# EAGLE board teensyShield4.1b (EAGLE 7.7.0)
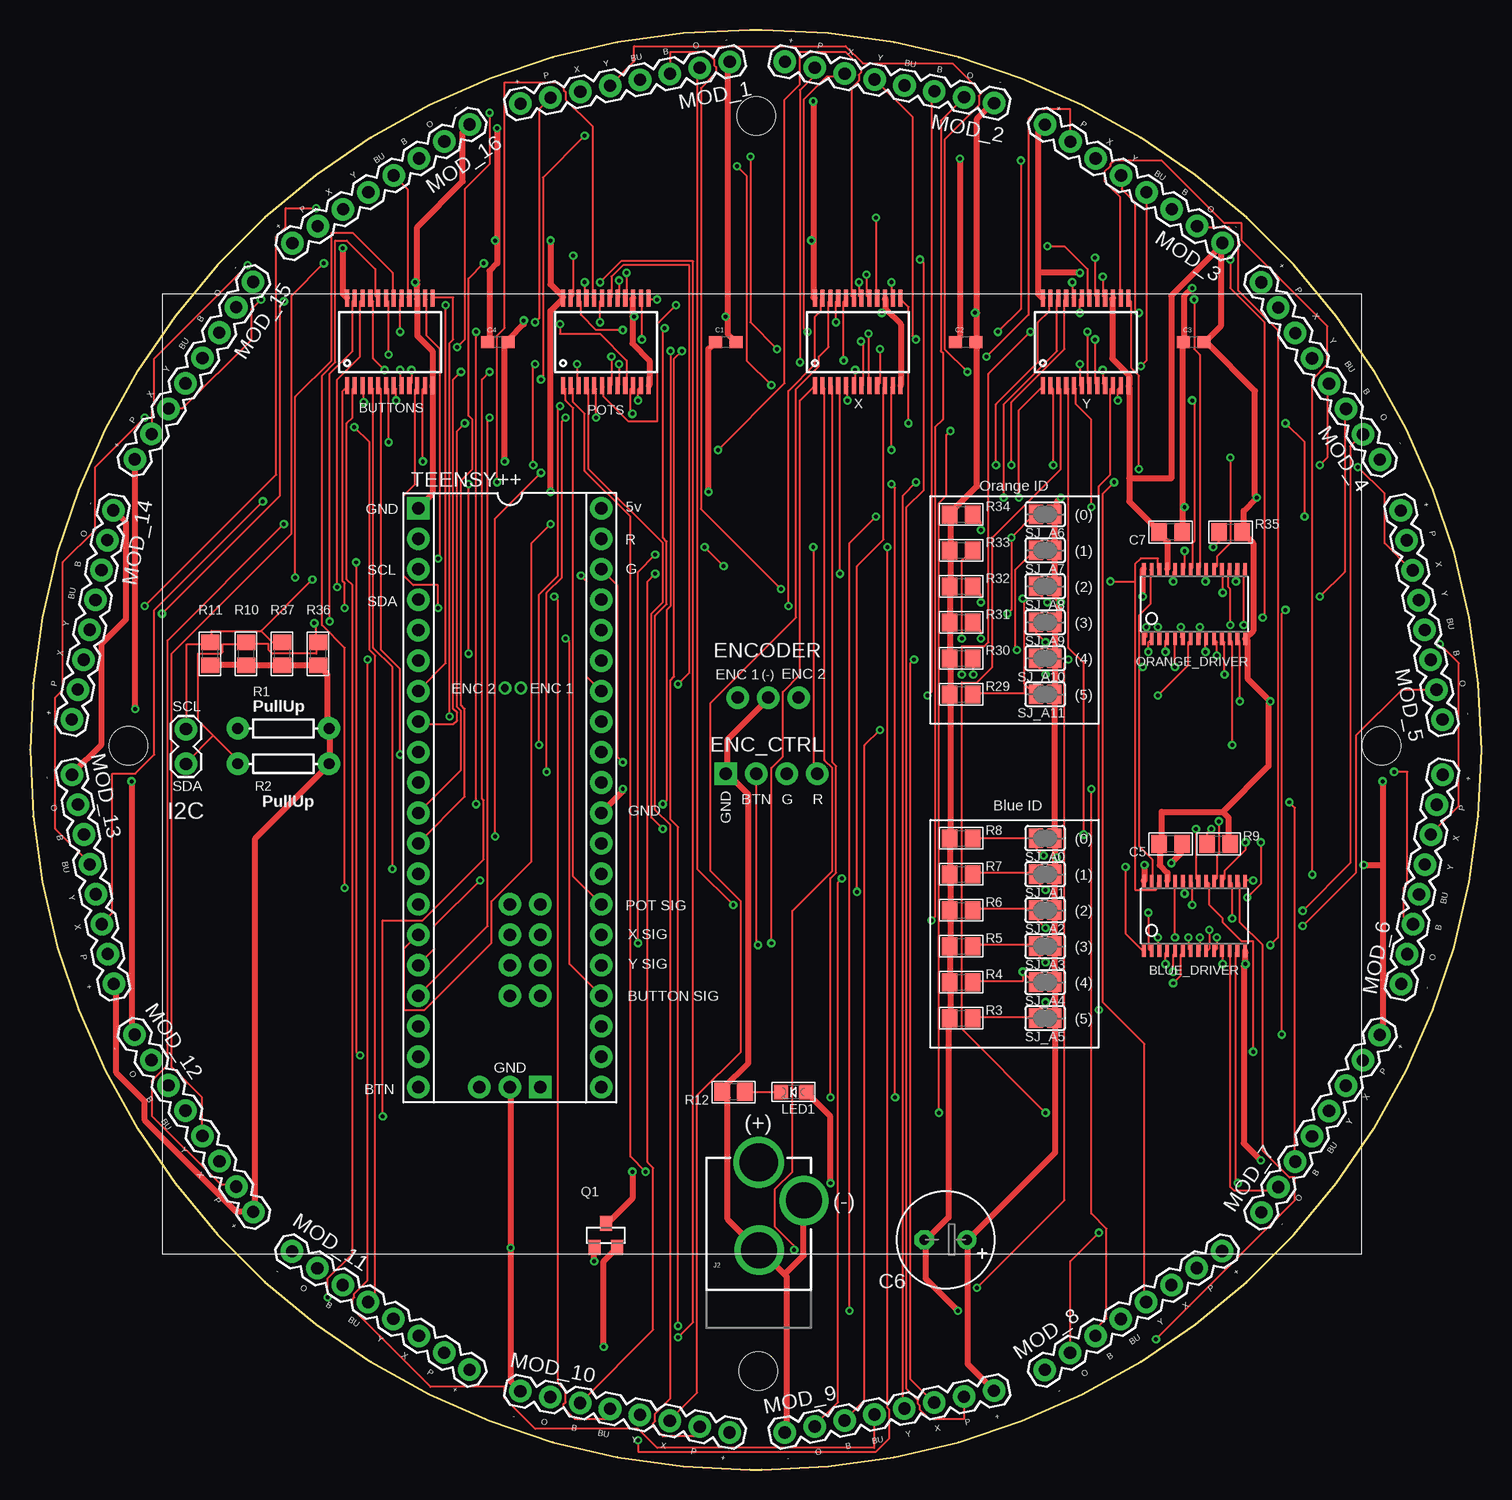
[diagram p2: board, top side]
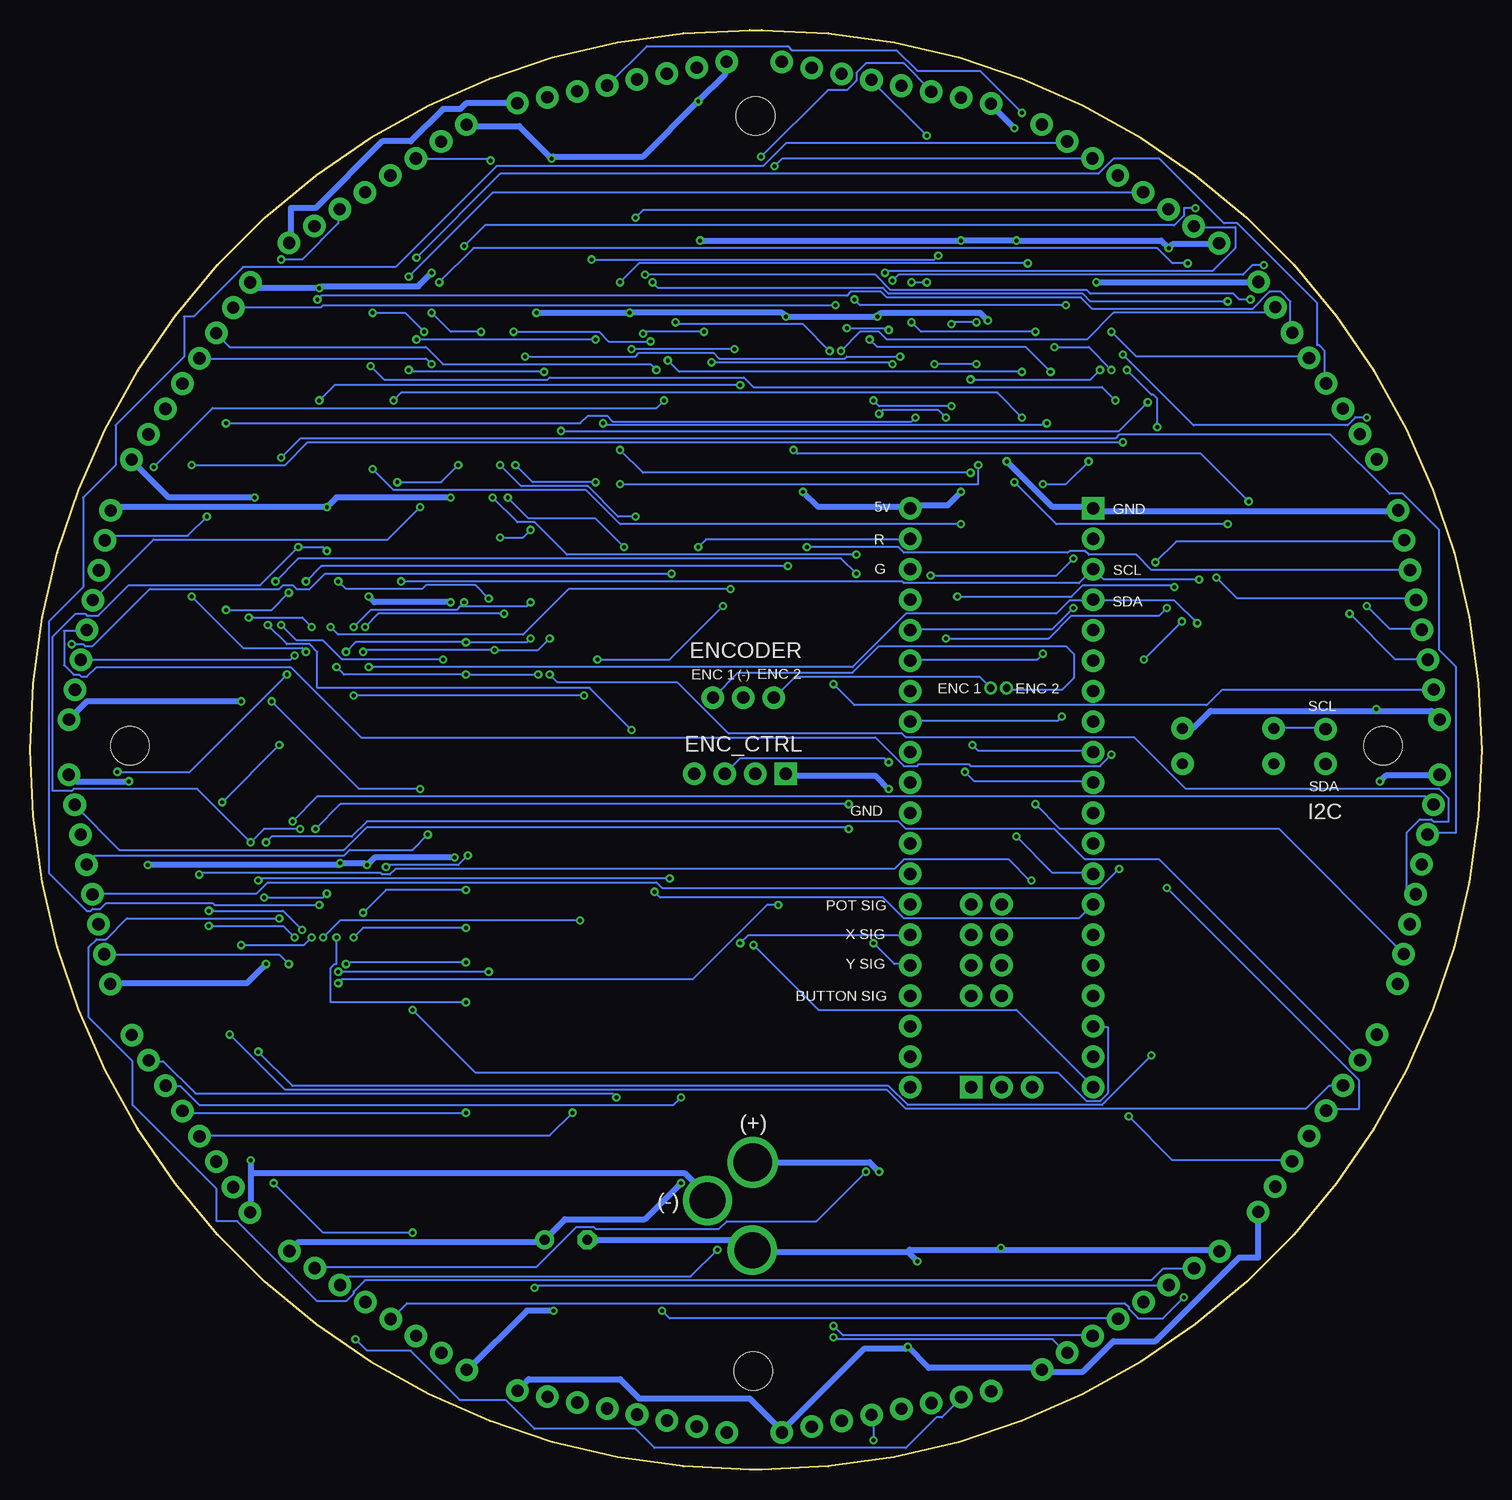
[diagram p3: board, bottom side, seen from below]

Size 121 x 120 mm. Coordinates in mm from the lower left corner, seen from the top.
Outline: 60,0 61,0 arc90 121,60 arc90 61,120 60,120 arc90 0,60 arc90 60,0
Copper layers (1*16): Top 0.0356mm / dielectric 1.5011mm / Bottom 0.0356mm
Design rules "oshpark-2layer": minimum track width 6mil, minimum drill 13mil, track to track 6mil, track to pad 6mil, pad to pad 6mil, via to via 6mil, smd to smd 6mil, copper to edge 15mil, drill to drill 6mil, minimum pad ring 7mil, minimum via ring 7mil, stop-mask expansion 2.5mil, vias tented up to drill 0mil, thermal gap 10mil
Net classes: 1 GND: width 0.508 mm; 2 5V: width 0.508 mm
Holes 3.2 mm at 8.2,60.35 60.7,8.2 112.67,60.35 60.52,112.85

## Footprints (pad centres in the part's own frame; a part is rotated, then mirrored left to right if it is on the bottom)
TSSOP28 = smd 0.305 x 0.991: 1 -4.225,-2.918; 2 -3.575,-2.918; 3 -2.925,-2.918; 4 -2.275,-2.918; 5 -1.625,-2.918; 6 -0.975,-2.918; 7 -0.325,-2.918; 8 0.325,-2.918; 9 0.975,-2.918; 10 1.625,-2.918; 11 2.275,-2.918; 12 2.925,-2.918; 13 3.575,-2.918; 14 4.225,-2.918; 15 4.225,2.918; 16 3.575,2.918; 17 2.925,2.918; 18 2.275,2.918; 19 1.625,2.918; 20 0.975,2.918; 21 0.325,2.918; 22 -0.325,2.918; 23 -0.975,2.918; 24 -1.625,2.918; 25 -2.275,2.918; 26 -2.925,2.918; 27 -3.575,2.918; 28 -4.225,2.918
SSOP24 = smd 0.348 x 1.397: 1 -3.575,-3.656; 2 -2.925,-3.656; 3 -2.275,-3.656; 4 -1.625,-3.656; 5 -0.975,-3.656; 6 -0.325,-3.656; 7 0.325,-3.656; 8 0.975,-3.656; 9 1.625,-3.656; 10 2.275,-3.656; 11 2.925,-3.656; 12 3.575,-3.656; 13 3.575,3.656; 14 2.925,3.656; 15 2.275,3.656; 16 1.625,3.656; 17 0.975,3.656; 18 0.325,3.656; 19 -0.325,3.656; 20 -0.975,3.656; 21 -1.625,3.656; 22 -2.275,3.656; 23 -2.925,3.656; 24 -3.575,3.656
0603 = smd 1.1 x 1: 1 -0.85,0; 2 0.85,0
0805 = smd 1.3 x 1.5: 1 -0.95,0; 2 0.95,0
E3,5-8 = drill 0.813 pad 1.6: + -1.778,0 | drill 0.813 pad 1.6 octagon: - 1.778,0
1X04_NO_SILK = drill 1.016 pad 1.88 square: 1 0,0 | drill 1.016 pad 1.88: 2 2.54,0; 3 5.08,0; 4 7.62,0
1X03_NO_SILK = drill 1.016 pad 1.88: 1 0,0; 2 2.54,0; 3 5.08,0
1X02_LOCK = drill 1.016 pad 1.88: 1 -0.178,0; 2 2.718,0
POWER_JACK_PTH_LOCK = drill 2.997 pad 4.115: GND 0.025,6.557; GNDBREAK 3.762,10.7 | drill 3.2 pad 4.115: PWR 0,13.878
CHIPLED_0805 = smd 1.2 x 1.2: A 0,-1.05; C 0,1.05
1X08_ROUND = drill 1.016 pad 1.88: 1 0,0; 2 2.54,0; 3 5.08,0; 4 7.62,0; 5 10.16,0; 6 12.7,0; 7 15.24,0; 8 17.78,0
SOT23-WIDE = smd 1 x 1.27: 1 -0.95,-1; 2 0.95,-1; 3 0,1
AXIAL-0.3 = drill 0.9 pad 1.88: P$1 -3.81,0; P$2 3.81,0
SOLDERJUMPER_REFLOW_NOPASTE = smd 1.168 x 1.6: 1 -0.762,0; 2 0.762,0
TEENSY++ = drill 1.016 pad 1.88: 5V 24.13,-2.54; +5V -24.13,7.62; A0 8.89,0; A1 11.43,0; A2 13.97,0; A3 16.51,0; A4 8.89,2.54; A5 11.43,2.54; A6 13.97,2.54; A7 16.51,2.54; B0 -6.35,7.62; B1 -8.89,7.62; B2 -11.43,7.62; B3 -13.97,7.62; B4 -16.51,7.62; B5 -19.05,7.62; B6 -21.59,7.62; B7 -21.59,-7.62; C0 6.35,-7.62; C1 8.89,-7.62; C2 11.43,-7.62; C3 13.97,-7.62; C4 16.51,-7.62; C5 19.05,-7.62; C6 21.59,-7.62; C7 24.13,-7.62; D0 -19.05,-7.62; D1 -16.51,-7.62; D2 -13.97,-7.62; D3 -11.43,-7.62; D4 -8.89,-7.62; D5 -6.35,-7.62; D6 -3.81,-7.62; D7 -1.27,-7.62; E0 1.27,-7.62; E1 3.81,-7.62; E6 -1.27,7.62; E7 -3.81,7.62; F0 6.35,7.62; F1 8.89,7.62; F2 11.43,7.62; F3 13.97,7.62; F4 16.51,7.62; F5 19.05,7.62; F6 21.59,7.62; F7 24.13,7.62; GND2 24.13,0; GRND1 1.27,7.62; REF 3.81,7.62 | drill 0.635 pad 1.067: E4 -9.144,0.914; E5 -9.144,-0.406 | drill 1.016 pad 1.88 square: GND -24.13,-7.62; RST 24.13,2.54

## Placement (x,y rotation side)
BLUE_DRIVER  PCA9685  [TSSOP28]  97.08,46.15 0 top
BUTTONS  MUX-74HC4067  [SSOP24]  30,94 0 top
C1  0.1uF  [0603]  58,94 0 top
C2  0.1uF  [0603]  78,94 0 top
C3  0.1uF  [0603]  97,94 0 top
C4  0.1uF  [0603]  39,94 0 top
C5  10uF  [0805]  95.08,52.15 180 top
C6  [E3,5-8]  76.33,19.15 180 top
C7  10uF  [0805]  95.08,78.15 180 top
ENC_CTRL  [1X04_NO_SILK]  58,58 0 top
ENCODER  [1X03_NO_SILK]  64.08,64.35 180 top
I2C  [1X02_LOCK]  13,59 90 top
J2  POWER_JACKPTH_LOCK  [POWER_JACK_PTH_LOCK]  60.76,11.72 0 top
LED1  VCC  [CHIPLED_0805]  63.65,31.48 90 top
MOD_1  [1X08_ROUND]  58.33,117.34 191.3 top
MOD_2  [1X08_ROUND]  80.37,113.9 168.8 top
MOD_3  [1X08_ROUND]  99.41,102.24 146.3 top
MOD_4  [1X08_ROUND]  112.53,84.19 123.8 top
MOD_5  [1X08_ROUND]  117.75,62.51 101.3 top
MOD_6  [1X08_ROUND]  114.31,40.47 78.8 top
MOD_7  [1X08_ROUND]  102.65,21.43 56.3 top
MOD_8  [1X08_ROUND]  84.6,8.31 33.8 top
MOD_9  [1X08_ROUND]  62.92,3.09 11.3 top
MOD_10  [1X08_ROUND]  40.88,6.53 348.8 top
MOD_11  [1X08_ROUND]  21.84,18.19 326.3 top
MOD_12  [1X08_ROUND]  8.72,36.24 303.8 top
MOD_13  [1X08_ROUND]  3.5,57.92 281.3 top
MOD_14  [1X08_ROUND]  6.94,79.96 258.8 top
MOD_15  [1X08_ROUND]  18.6,99 236.3 top
MOD_16  [1X08_ROUND]  36.65,112.12 213.8 top
ORANGE_DRIVER  PCA9685  [TSSOP28]  97.08,72.15 0 top
POTS  MUX-74HC4067  [SSOP24]  48,94 0 top
Q1  IRLML6401  [SOT23-WIDE]  48,19.52 0 top
R1  PullUp  [AXIAL-0.3]  21.12,61.77 0 top
R2  PullUp  [AXIAL-0.3]  21.12,58.83 180 top
R3  10K  [0805]  77.62,37.62 0 top
R4  10K  [0805]  77.62,40.62 0 top
R5  10K  [0805]  77.62,43.62 0 top
R6  10K  [0805]  77.62,46.62 0 top
R7  10K  [0805]  77.62,49.62 0 top
R8  10K  [0805]  77.62,52.62 0 top
R9  10K  [0805]  99.08,52.15 0 top
R10  10K  [0805]  18,68 270 top
R11  10K  [0805]  15,68 270 top
R12  220  [0805]  58.65,31.48 180 top
R29  10K  [0805]  77.62,64.62 0 top
R30  10K  [0805]  77.62,67.62 0 top
R31  10K  [0805]  77.62,70.62 0 top
R32  10K  [0805]  77.62,73.62 0 top
R33  10K  [0805]  77.62,76.62 0 top
R34  10K  [0805]  77.62,79.62 0 top
R35  10K  [0805]  100.08,78.15 0 top
R36  10K  [0805]  24,68 270 top
R37  10K  [0805]  21,68 270 top
SJ_A0  [SOLDERJUMPER_REFLOW_NOPASTE]  84.62,52.62 180 top
SJ_A1  [SOLDERJUMPER_REFLOW_NOPASTE]  84.62,49.62 180 top
SJ_A2  [SOLDERJUMPER_REFLOW_NOPASTE]  84.62,46.62 180 top
SJ_A3  [SOLDERJUMPER_REFLOW_NOPASTE]  84.62,43.62 180 top
SJ_A4  [SOLDERJUMPER_REFLOW_NOPASTE]  84.62,40.62 180 top
SJ_A5  [SOLDERJUMPER_REFLOW_NOPASTE]  84.62,37.62 180 top
SJ_A6  [SOLDERJUMPER_REFLOW_NOPASTE]  84.62,79.62 180 top
SJ_A7  [SOLDERJUMPER_REFLOW_NOPASTE]  84.62,76.62 180 top
SJ_A8  [SOLDERJUMPER_REFLOW_NOPASTE]  84.62,73.62 180 top
SJ_A9  [SOLDERJUMPER_REFLOW_NOPASTE]  84.62,70.62 180 top
SJ_A10  [SOLDERJUMPER_REFLOW_NOPASTE]  84.62,67.62 180 top
SJ_A11  [SOLDERJUMPER_REFLOW_NOPASTE]  84.62,64.62 180 top
TEENSY++  ARDUINO-TEENSY++  [TEENSY++]  40,56 270 top
X  MUX-74HC4067  [SSOP24]  69,94 0 top
Y  MUX-74HC4067  [SSOP24]  88,94 0 top

## Tracks (layer width: path | path; a pad name or v marks a point on that pad's centre or on a via)
5V  (via drill 0.33)
  Top 0.508: R11.2 15.13,67.05 17.98,67.05 R10.2 18.14,67.05 20.84,67.05 R37.2 21.16,67.05 23.86,67.05 R36.2 24.18,66.9 24.81,66.26 24.81,61.97 R1.P$2 24.97,61.66 24.97,58.96 R2.P$1 24.81,58.64 18.78,52.61 18.78,21.65 MOD_12.8 18.46,21.49 17.19,21.49 9.57,29.11 9.57,30.7 7.19,33.08 7.19,40.23 7.03,40.38 MOD_13.8 | v8.78,63.4 8.78,84.2 MOD_15.8 | v47.83,10.22 47.83,17.36 48.94,18.48 Q1.2 | v56.56,81.5 56.56,93.41 57.04,93.88 C1.1 | v43.38,81.5 43.38,96.58 44.34,97.53 POTS.24 44.34,97.85 43.38,98.8 v43.38,102.45 | v26.08,101.82 26.08,98.01 26.4,97.69 BUTTONS.24 | v38.94,111.82 38.94,102.45 | 38.94,102.45 38.94,100.55 38.3,99.92 38.3,94.04 C4.1 | v38.78,102.45 38.94,102.45 | v66.72,23.87 66.72,29.43 64.82,31.34 LED1.A | MOD_9.8 80.22,6.73 78.15,8.79 78.15,19.11 C6.+ 78.31,19.27 85.45,26.41 85.45,37.37 SJ_A5.1 85.45,37.69 85.45,40.54 SJ_A4.1 85.45,40.86 85.45,43.56 SJ_A3.1 85.45,43.88 85.45,46.58 SJ_A2.1 85.45,46.73 85.45,49.43 SJ_A1.1 85.45,49.75 85.45,51.02 | v65.29,114.04 65.29,102.45 | 65.29,102.45 65.29,97.69 X.24 | v77.52,109.28 77.52,94.36 77.2,94.04 C2.1 | 84.03,99.76 84.03,111.5 84.5,111.98 MOD_3.8 | 84.03,99.76 84.03,98.01 84.34,97.69 Y.24 | 96.09,80.23 96.09,78.17 C7.1 | 96.09,80.23 96.09,93.88 C3.1 96.25,94.2 96.25,97.85 v96.88,98.49 | v96.25,80.23 96.09,80.23 | v112.76,57.37 112.76,50.38 | 112.76,50.38 112.76,36.41 112.6,36.26 MOD_7.8 | v92.76,72.77 92.76,74.99 ORANGE_DRIVER.28 | v92.92,50.38 92.92,49.11 BLUE_DRIVER.28 | v95.14,50.54 95.93,51.34 95.93,52.13 C5.1 | 85.45,51.02 85.45,52.61 SJ_A0.1 85.45,52.77 85.45,64.51 SJ_A11.1 85.45,64.67 85.45,67.53 SJ_A10.1 85.45,67.85 85.45,70.39 SJ_A9.1 85.45,70.7 85.77,71.02 85.77,72.13 v85.93,72.29 85.45,72.77 85.45,73.56 SJ_A8.1 85.45,73.88 85.45,76.58 SJ_A7.1 85.45,76.74 85.45,79.59 SJ_A6.1 85.61,79.75 85.61,80.71 v85.93,81.02
  Top 0.508: v85.61,51.02 85.45,51.02 | v111.17,50.38 112.76,50.38 | v87.52,99.76 84.03,99.76 | v65.13,102.45 65.29,102.45
  Bottom 0.508: 8.78,63.24 22.59,63.24 24.02,61.81 24.81,61.81 R1.P$2 | 8.78,63.24 4.17,63.24 3.54,62.61 MOD_14.8 | v8.78,63.4 8.78,63.24 | MOD_12.8 18.62,21.33 18.62,17.68 20.21,17.68 27.19,10.7 30.68,10.7 33.23,8.16 36.56,8.16 MOD_11.8 36.72,8.47 46.08,8.47 v47.83,10.22 47.99,10.06 51.48,10.06 58.31,3.24 MOD_10.8 58.47,3.39 61.01,5.94 70.21,5.94 71.8,7.52 79.42,7.52 80.22,6.73 MOD_9.8 | v56.56,81.5 55.29,80.23 47.67,80.23 TEENSY++.+5V 47.51,80.39 44.5,80.39 v43.38,81.5 | MOD_16.8 21.95,102.14 25.76,102.14 v26.08,101.82 26.72,102.45 v38.78,102.45 v43.38,102.45 v65.13,102.45 | v38.94,111.82 40.84,113.73 MOD_1.8 | v66.72,23.87 69.74,20.86 76.41,20.86 77.99,19.27 C6.+ 78.15,18.95 98.63,18.95 99.27,18.32 MOD_8.8 | MOD_2.8 63.07,117.22 63.07,116.27 v65.29,114.04 69.9,109.44 77.36,109.44 v77.52,109.28 80.22,111.98 84.5,111.98 MOD_3.8 | MOD_4.8 102.6,98.96 102.12,98.49 v96.88,98.49 96.72,98.64 88.63,98.64 v87.52,99.76 | MOD_5.8 114.19,80.07 114.03,80.23 v96.25,80.23 95.45,81.02 v85.93,81.02 | v112.76,57.37 117.2,57.37 117.68,57.85 MOD_6.8 | v92.76,72.77 92.28,72.29 v85.93,72.29 | v85.61,51.02 92.28,51.02 v92.92,50.38 93.07,50.54 v95.14,50.54 95.3,50.38 v111.17,50.38
B_A0  (via drill 0.33)
  Top 0.152: v91.33,50.23 91.33,44.67 92.76,43.24 BLUE_DRIVER.1 | v84.5,51.18 83.87,51.81 83.87,52.61 SJ_A0.2 83.71,52.61 78.63,52.61 R8.2
  Bottom 0.152: v91.33,50.23 91.17,50.38 85.3,50.38 v84.5,51.18
B_A1  (via drill 0.33)
  Top 0.152: v93.23,46.42 93.23,43.4 93.39,43.24 BLUE_DRIVER.2 | v84.66,48.32 83.87,49.11 83.87,49.59 SJ_A1.2 83.71,49.75 78.63,49.75 R7.2
  Bottom 0.152: v93.23,46.42 91.33,48.32 v84.66,48.32
B_A2  (via drill 0.33)
  Top 0.152: v94.03,44.35 94.03,43.24 BLUE_DRIVER.3 | v84.66,45.15 83.87,45.94 83.87,46.58 SJ_A2.2 83.71,46.73 78.63,46.73 R6.2
  Bottom 0.152: v94.03,44.35 93.23,45.15 v84.66,45.15
B_A3  (via drill 0.33)
  Top 0.152: v94.66,42.13 94.66,43.08 BLUE_DRIVER.4 | v84.66,42.29 83.87,43.08 83.87,43.56 SJ_A3.2 83.71,43.72 78.63,43.72 R5.2
  Bottom 0.152: v94.66,42.13 94.5,42.29 v84.66,42.29
B_A4  (via drill 0.33)
  Top 0.152: v95.3,41.5 95.3,42.92 95.45,43.08 BLUE_DRIVER.5 | SJ_A4.2 83.71,40.54 v82.75,41.5 82.75,40.7 78.63,40.7 R4.2
  Bottom 0.152: v82.75,41.5 v95.3,41.5
B_A5  (via drill 0.33)
  Top 0.152: v95.45,44.35 95.45,48.96 BLUE_DRIVER.24 | v84.66,38.95 83.87,38.16 83.87,37.69 SJ_A5.2 83.71,37.69 78.63,37.69 R3.2
  Bottom 0.152: v95.45,44.35 95.45,42.13 95.61,42.13 95.93,41.81 95.93,38.95 v84.66,38.95
ENC_1
  Bottom 0.152: ENCODER.3 58.94,64.35 57.2,66.1 41.87,66.1 TEENSY++.E4
ENC_2
  Bottom 0.152: ENCODER.1 64.02,64.35 61.96,66.42 52.43,66.42 50.21,68.64 34.64,68.64 34,68 34,66 35,65 39.45,65 TEENSY++.E5
ENC_BU  (via drill 0.33)
  Top 0.152: v60.69,43.72 60.53,43.88 60.53,57.85 ENC_CTRL.2
  Bottom 0.152: v60.69,43.72 55.29,38.32 38.78,38.32 32.43,31.97 TEENSY++.C7
ENC_G  (via drill 0.33)
  Top 0.152: v49.42,58.96 48.94,59.43 48.94,73.72 47.67,74.99 TEENSY++.B5
  Bottom 0.152: v49.42,58.96 49.73,59.27 61.8,59.27 ENC_CTRL.3
ENC_R  (via drill 0.33)
  Top 0.152: v65.29,76.9 65.29,58.32 ENC_CTRL.4
  Bottom 0.152: v65.29,76.9 64.66,77.53 47.67,77.53 TEENSY++.B6
GND  (via drill 0.33)
  Top 0.508: BLUE_DRIVER.14 101.33,43.08 v101.33,42.13 101.17,41.97 101.17,27.21 v102.6,25.78 | MOD_10.1 40.84,6.57 40.05,7.36 v40.05,18.48 40.05,31.81 TEENSY++.GND2 | v49.42,56.73 49.42,56.58 47.67,54.83 TEENSY++.GRND1 | ENCODER.2 61.48,64.2 58.15,60.86 58.15,58.01 ENC_CTRL.1 58.31,57.85 59.9,56.26 59.9,33.88 57.83,31.81 57.83,31.65 R12.2 57.83,31.34 58.15,31.02 58.15,20.86 60.69,18.32 J2.GND 61.01,18.16 62.91,16.25 | v47.04,17.36 47.04,18.48 Q1.1 | 62.91,16.25 63.07,16.09 63.07,3.24 MOD_9.1 | v77.36,13.24 74.66,15.94 74.66,19.11 C6.- 74.82,19.27 76.56,21.02 76.56,37.53 R3.1 76.72,37.69 76.72,40.54 R4.1 76.72,40.86 76.72,43.56 R5.1 76.72,43.72 76.72,46.42 R6.1 76.72,46.73 76.72,49.59 R7.1 76.72,49.75 76.72,52.61 R8.1 76.72,52.77 76.72,64.51 R29.1 76.72,64.67 76.72,67.53 R30.1 76.72,67.85 76.72,70.55 R31.1 76.72,70.86 76.72,73.56 R32.1 76.72,73.72 76.72,76.42 R33.1 76.72,76.74 76.72,79.44 R34.1 76.72,79.75 78.94,81.98 78.94,93.88 C2.2 78.94,94.2 78.94,96.42 | 62.91,16.25 64.5,17.84 64.5,22.29 J2.GNDBREAK | MOD_13.1 3.54,58.01 5.92,60.39 5.92,68.8 7.98,70.86 7.98,78.96 7.03,79.91 MOD_14.1 | v8.46,57.37 8.46,36.41 8.62,36.26 MOD_12.1 | v39.58,84.04 39.58,93.72 39.73,93.88 C4.2 39.89,94.2 41.16,95.47 v41.16,95.79 | MOD_16.1 36.56,111.98 36.08,111.5 36.08,107.38 32.27,103.57 32.27,99.12 v32.11,98.96 32.27,98.8 32.27,97.85 BUTTONS.15 32.27,97.53 32.27,94.52 33.54,93.25 33.54,90.39 BUTTONS.12 33.54,90.23 33.54,81.34 32.43,80.23 TEENSY++.GND | ORANGE_DRIVER.25 94.82,75.15 94.82,77.37 94.19,78.01 C7.2 94.03,78.33 91.64,80.71 91.64,82.61
  Top 0.508: Y.15 90.22,97.53 90.22,92.61 91.64,91.18 91.64,90.39 Y.12 91.64,90.23 91.64,82.61 | BLUE_DRIVER.25 94.82,49.11 94.82,49.75 94.19,50.38 94.19,52.13 C5.2 94.34,52.29 94.34,54.83 99.42,54.83 | 99.42,54.83 99.9,54.35 99.9,52.29 R9.2 | 101.33,69.28 101.96,69.91 101.96,77.21 101.17,78.01 R35.2 101.17,78.33 101.17,79.91 v102.28,81.02 102.12,81.18 102.12,89.91 98.15,93.88 C3.2 98,94.04 99.27,95.31 99.27,102.14 MOD_3.1 99.11,101.82 95.14,97.85 95.14,82.61 91.64,82.61 | 101.33,69.28 ORANGE_DRIVER.14 | 101.33,69.28 101.49,69.12 101.49,65.94 v103.39,64.04 103.23,63.88 103.23,58.64 99.42,54.83 | 71.33,96.74 72.59,95.47 72.59,90.39 X.12 | 71.33,96.74 71.33,97.53 X.15 | 50.21,96.11 50.21,97.53 POTS.15 | 50.21,96.11 50.21,93.88 51.64,92.45 51.64,90.39 POTS.12 | 58.15,96.11 58.15,117.06 58.31,117.22 MOD_1.1 | 58.15,96.11 58.15,94.68 58.78,94.04 C1.2 | v50.37,96.11 50.21,96.11 | v57.99,96.11 58.15,96.11 | v71.01,96.42 71.33,96.74 | 78.94,96.42 78.94,112.61 80.22,113.89 MOD_2.1 | v78.79,96.42 78.94,96.42
  Bottom 0.508: v101.33,42.13 102.92,40.54 114.19,40.54 MOD_6.1 | v102.6,25.78 102.6,24.67 | 102.6,24.67 102.6,21.49 MOD_7.1 | v49.42,56.73 50.53,57.85 57.99,57.85 ENC_CTRL.1 | 47.83,18.16 v47.04,17.36 | 47.83,18.16 60.69,18.16 J2.GND 61.01,18.32 61.8,19.11 74.5,19.11 C6.- | 40.05,18.32 47.67,18.32 47.83,18.16 | 40.05,18.32 21.95,18.32 MOD_11.1 | v77.36,13.24 79.58,13.24 84.5,8.32 MOD_8.1 | v40.05,18.48 40.05,18.32 | 102.6,24.67 66.4,24.67 64.66,22.92 64.66,22.45 J2.GNDBREAK | v8.46,57.37 7.98,57.85 3.54,57.85 MOD_13.1 | v39.58,84.04 35.77,80.23 32.43,80.23 TEENSY++.GND 32.27,79.91 7.03,79.91 MOD_14.1 | v32.11,98.96 18.62,98.96 MOD_15.1 | v103.39,64.04 116.25,64.04 117.68,62.61 MOD_5.1 | v102.28,81.02 109.42,81.02 112.44,84.04 MOD_4.1 | v78.79,96.42 v71.01,96.42 58.31,96.42 v57.99,96.11 v50.37,96.11 50.05,96.42 41.8,96.42 v41.16,95.79 | MOD_3.1 99.27,102.3 99.27,105.15 97.2,105.15 91.64,110.71 89.26,110.71 86.56,113.41 85.14,113.41 84.66,113.89 80.37,113.89 MOD_2.1
M1_BTN  (via drill 0.33)
  Top 0.152: v31.8,91.66 31.8,90.55 31.64,90.39 BUTTONS.9 | v42.59,90.87 42.75,91.03 42.75,107.69 v46.24,111.19
  Bottom 0.152: v31.8,91.66 32.59,90.87 v42.59,90.87 | v46.24,111.19 50.85,115.79 MOD_1.4
M1_LED1  (via drill 0.33)
  Top 0.152: v95.3,40.54 95.93,41.18 95.93,42.92 96.09,43.08 BLUE_DRIVER.6 | v58.62,47.05 55.61,50.07 55.61,116.58 55.77,116.74 MOD_1.2
  Bottom 0.152: v95.3,40.54 94.98,40.86 65.77,40.86 59.58,47.05 v58.62,47.05
M1_LED2  (via drill 0.33)
  Top 0.152: v95.93,70.23 95.93,69.44 96.09,69.28 ORANGE_DRIVER.6 | v62.59,73.4 55.93,80.07 55.93,115.16 57.2,116.42 57.2,116.9 57.04,117.06 57.04,117.54 56.4,118.17 53.39,118.17 53.39,116.42 MOD_1.3
  Bottom 0.152: v95.93,70.23 95.3,69.59 79.9,69.59 76.09,73.4 v62.59,73.4
M1_POT  (via drill 0.33)
  Top 0.152: v44.18,95.47 44.18,94.68 47.51,94.68 49.73,92.45 49.73,90.39 POTS.9 | v42.11,95.63 42.43,95.95 42.43,113.41 43.23,114.2 MOD_1.7
  Bottom 0.152: v44.18,95.47 44.02,95.63 v42.11,95.63
M1_X  (via drill 0.33)
  Top 0.152: v70.85,93.41 70.85,90.55 70.69,90.39 X.9 | v62.28,93.41 60.05,95.63 v60.05,109.44
  Bottom 0.152: v62.28,93.41 v70.85,93.41 | v60.05,109.44 54.5,115 52.91,115 52.12,115.79 52.12,116.42 51.32,117.22 48.15,117.22 45.92,115 MOD_1.6
M1_Y  (via drill 0.33)
  Top 0.152: v89.42,91.66 89.42,90.55 89.58,90.39 Y.9 | v78.15,91.5 76.25,93.41 76.25,110.87 79.1,113.73 79.1,114.52 79.26,114.68 79.26,114.84 76.88,117.22 69.42,117.22 67.99,118.65 50.37,118.65 50.37,117.38 48.47,115.47 MOD_1.5
  Bottom 0.152: v89.42,91.66 89.26,91.5 v78.15,91.5
M2_BTN  (via drill 0.33)
  Top 0.152: v30.84,91.66 30.84,90.39 BUTTONS.8 | v35.61,93.56 36.24,94.2 36.24,106.74 38.3,108.81 v38.3,113.09
  Bottom 0.152: v30.84,91.66 32.75,93.56 v35.61,93.56 | v38.3,113.09 41.8,116.58 47.04,116.58 48.78,118.33 57.51,118.33 57.83,118.65 69.58,118.65 72.75,115.47 MOD_2.4
M2_LED1  (via drill 0.33)
  Top 0.152: v96.57,44.35 96.57,43.4 96.72,43.24 BLUE_DRIVER.7 | v75.14,45.78 75.45,46.1 75.45,86.9 76.09,87.53 76.09,93.09 75.93,93.25 75.93,112.46 77.83,114.36 MOD_2.2
  Bottom 0.152: v96.57,44.35 95.14,45.78 v75.14,45.78
M2_LED2  (via drill 0.33)
  Top 0.152: v94.03,64.51 96.57,67.05 96.57,68.96 96.72,69.12 ORANGE_DRIVER.7 | v74.82,64.51 75.14,64.83 75.14,114.68 75.29,114.84 MOD_2.3
  Bottom 0.152: v74.82,64.51 v94.03,64.51
M2_POT  (via drill 0.33)
  Top 0.152: v49.1,92.14 49.1,90.39 POTS.8 | v64.18,92.3 64.18,115 65.29,116.11 65.29,116.74 MOD_2.7
  Bottom 0.152: v49.1,92.14 49.26,92.3 v64.18,92.3
M2_X  (via drill 0.33)
  Top 0.152: v69.9,94.68 69.9,90.39 X.8 | v64.82,94.83 64.5,95.15 64.5,114.2 66.4,116.11 67.83,116.11 67.83,116.27 MOD_2.6
  Bottom 0.152: v69.9,94.68 69.74,94.83 v64.82,94.83
M2_Y  (via drill 0.33)
  Top 0.152: v88.79,94.2 88.79,90.55 88.95,90.39 Y.8 | v73.87,94.2 73.55,94.52 73.55,112.77 70.53,115.79 MOD_2.5
  Bottom 0.152: v73.87,94.2 v88.79,94.2
M3_BTN  (via drill 0.33)
  Top 0.152: v30.53,89.12 30.53,90.07 30.37,90.23 BUTTONS.7 | v92.6,91.98 93.07,92.45 93.07,106.42 MOD_3.4
  Bottom 0.152: v30.53,89.12 31.64,90.23 60.69,90.23 61.48,91.03 77.67,91.03 77.83,90.87 91.49,90.87 v92.6,91.98
M3_LED1  (via drill 0.33)
  Top 0.152: v97.52,44.35 97.52,43.24 BLUE_DRIVER.8 | v103.39,43.72 104.03,44.35 104.03,94.99 100.69,98.33 100.69,102.77 99.9,103.57 97.36,103.57 MOD_3.2
  Bottom 0.152: v97.52,44.35 98.15,43.72 v103.39,43.72
M3_LED2  (via drill 0.33)
  Top 0.152: v97.52,70.23 97.52,69.28 ORANGE_DRIVER.8 | v102.76,71.02 102.92,71.18 102.92,95.63 100.06,98.49 v100.06,100.87
  Bottom 0.152: v97.52,70.23 98.31,71.02 v102.76,71.02 | v100.06,100.87 98.31,100.87 95.3,103.88 95.3,105 MOD_3.3
M3_POT  (via drill 0.33)
  Top 0.152: v48.47,92.77 48.47,90.39 POTS.7 | v79.74,92.77 83.23,96.26 83.23,112.61 84.03,113.41 86.72,113.41 MOD_3.7
  Bottom 0.152: v48.47,92.77 52.91,92.77 53.07,92.61 63.55,92.61 64.02,93.09 70.21,93.09 70.53,92.77 v79.74,92.77
M3_X  (via drill 0.33)
  Top 0.152: v69.26,94.04 69.42,93.88 69.42,90.39 X.7 | v80.69,94.83 82.6,96.74 v82.6,109.12
  Bottom 0.152: v69.26,94.04 72.75,94.04 73.55,94.83 v80.69,94.83 | v82.6,109.12 82.75,109.28 88.79,109.28 MOD_3.6
M3_Y  (via drill 0.33)
  Top 0.152: v88.15,94.83 88.15,90.55 88.31,90.39 Y.7 | v92.44,96.42 92.12,96.74 92.12,105.63 91.01,106.74 91.01,107.85 MOD_3.5
  Bottom 0.152: v88.15,94.83 89.74,96.42 v92.44,96.42
M4_BTN  (via drill 0.33)
  Top 0.152: v29.89,85.63 29.89,90.07 29.73,90.23 BUTTONS.6 | v107.52,83.72 108.16,84.36 108.16,90.39 MOD_4.4
  Bottom 0.152: v29.89,85.63 97.84,85.63 99.74,83.72 v107.52,83.72
M4_LED1  (via drill 0.33)
  Top 0.152: v98.31,44.99 98.31,43.4 98.15,43.24 BLUE_DRIVER.9 | v106.09,46.58 110.06,50.54 110.06,85.31 111.01,86.26 MOD_4.2
  Bottom 0.152: v98.31,44.99 99.9,46.58 v106.09,46.58
M4_LED2  (via drill 0.33)
  Top 0.152: v98,68.16 98,69.12 ORANGE_DRIVER.9 | v107.52,72.77 109.58,74.83 109.58,88.33 MOD_4.3
  Bottom 0.152: v98,68.16 98.31,68.48 103.23,68.48 v107.52,72.77
M4_POT  (via drill 0.33)
  Top 0.152: v53.86,97.06 52.27,95.47 52.27,87.37 49.89,87.37 47.83,89.44 47.83,90.23 POTS.6
  Bottom 0.152: v53.86,97.06 96.57,97.06 96.72,96.9 104.03,96.9 MOD_4.7
M4_X  (via drill 0.33)
  Top 0.152: v68.78,91.66 68.78,90.39 X.6
  Bottom 0.152: v68.78,91.66 69.26,92.14 86.56,92.14 87.99,93.56 104.34,93.56 105.46,94.68 MOD_4.6
M4_Y  (via drill 0.33)
  Top 0.152: v87.52,92.14 87.52,90.39 Y.6
  Bottom 0.152: v87.52,92.14 87.99,92.61 106.73,92.61 MOD_4.5
M5_BTN  (via drill 0.33)
  Top 0.152: v30.84,59.59 30.84,66.74 29.26,68.32 29.26,90.07 29.1,90.23 BUTTONS.5
  Bottom 0.152: v30.84,59.59 31.8,58.64 42.59,58.64 42.75,58.8 46.88,58.8 47.04,58.64 48.15,58.64 50.53,61.02 93.39,61.02 99.27,66.9 115.46,66.9 116.25,66.1 116.73,66.1 116.89,66.26 117.36,66.26 118.16,67.05 118.16,69.91 116.41,69.91 MOD_5.4
M5_LED1  (via drill 0.33)
  Top 0.152: v98.95,44.35 98.95,43.4 98.79,43.24 BLUE_DRIVER.10 | v106.09,45.3 110.54,49.75 110.54,61.18 114.35,64.99 117.2,64.99 MOD_5.2
  Bottom 0.152: v98.95,44.35 99.9,45.3 v106.09,45.3
M5_LED2  (via drill 0.33)
  Top 0.152: v98.95,67.85 98.95,68.96 98.79,69.12 ORANGE_DRIVER.10
  Bottom 0.152: v98.95,67.85 99.27,67.53 116.73,67.53 MOD_5.3
M5_POT  (via drill 0.33)
  Top 0.152: v47.2,87.69 47.2,90.07 47.04,90.23 POTS.5 | v104.66,87.22 106.25,85.63 v106.25,79.44
  Bottom 0.152: v47.2,87.69 47.51,87.37 72.44,87.37 72.91,87.85 74.5,87.85 75.14,87.22 v104.66,87.22 | v106.25,79.44 107.84,77.85 114.35,77.85 114.66,77.53 MOD_5.7
M5_X  (via drill 0.33)
  Top 0.152: v68.15,89.12 68.15,90.23 X.5 | v110.69,83.56 112.92,81.34 112.92,77.21 115.14,74.99 MOD_5.6
  Bottom 0.152: v68.15,89.12 68.78,88.48 105.77,88.48 v110.69,83.56
M5_Y  (via drill 0.33)
  Top 0.152: v88.47,80.23 88.47,87.53 87.2,88.8 87.2,90.07 87.04,90.23 Y.5
  Bottom 0.152: v88.47,80.23 91.17,77.53 110.69,77.53 115.62,72.61 MOD_5.5
M6_BTN  (via drill 0.33)
  Top 0.152: v30.21,50.07 30.21,66.9 28.62,68.48 28.62,90.07 28.46,90.23 BUTTONS.4
  Bottom 0.152: v30.21,50.07 31.8,48.48 68.31,48.48 68.78,48.96 101.17,48.96 102.12,48 115.78,48 MOD_6.4
M6_LED1  (via drill 0.33)
  Top 0.152: v99.42,42.13 99.42,43.08 BLUE_DRIVER.11
  Bottom 0.152: v99.42,42.13 100.22,42.92 114.66,42.92 MOD_6.2
M6_LED2  (via drill 0.33)
  Top 0.152: v99.58,66.26 99.58,68.96 99.42,69.12 ORANGE_DRIVER.11 | v113.71,58.16 114.82,58.16 114.82,48.8 114.5,48.48 114.5,46.1 115.14,45.46 MOD_6.3
  Bottom 0.152: v99.58,66.26 107.68,58.16 v113.71,58.16
M6_POT  (via drill 0.33)
  Top 0.152: v52.75,53.4 51.8,54.35 51.8,71.34 52.75,72.29 52.75,77.21 46.56,83.41 46.56,90.07 46.4,90.23 POTS.4
  Bottom 0.152: v52.75,53.4 52.91,53.56 92.92,53.56 94.82,51.66 113.55,51.66 117.2,55.31 MOD_6.7
M6_X  (via drill 0.33)
  Top 0.152: v67.52,74.67 67.52,90.23 X.4 | v117.52,68.8 119.11,67.21 119.11,55.31 116.89,53.08 MOD_6.6
  Bottom 0.152: v67.52,74.67 96.41,74.67 97.68,73.4 98.79,73.4 99.11,73.72 99.9,73.72 100.22,73.4 111.01,73.4 115.78,68.64 116.41,68.64 116.57,68.8 v117.52,68.8
M6_Y  (via drill 0.33)
  Top 0.152: v87.83,52.92 87.83,67.21 86.56,68.48 86.56,90.07 86.41,90.23 Y.4
  Bottom 0.152: v87.83,52.92 89.11,51.66 94.34,51.66 94.82,51.18 115.62,51.18 116.25,50.54 MOD_6.5
M7_BTN  (via drill 0.33)
  Top 0.152: v27.83,88.96 27.83,90.23 BUTTONS.3 | v76.72,86.58 76.41,86.26 76.41,81.18 75.77,80.55 v75.77,29.75
  Bottom 0.152: v27.83,88.96 30.21,86.58 v76.72,86.58 | v75.77,29.75 77.67,27.84 106.73,27.84 MOD_7.4
M7_LED1
  Top 0.152: BLUE_DRIVER.12 100.06,43.08 100.06,23.56 100.38,23.24 104.03,23.24 104.03,23.4 MOD_7.2
M7_LED2  (via drill 0.33)
  Top 0.152: v100.22,60.39 100.22,68.96 100.06,69.12 ORANGE_DRIVER.12 | v104.98,55.62 105.46,55.15 105.46,25.78 MOD_7.3
  Bottom 0.152: v104.98,55.62 v100.22,60.39
M7_POT  (via drill 0.33)
  Top 0.152: v45.61,92.14 45.61,90.39 POTS.3 | v42.11,92.14 41.96,91.98 v41.96,83.72 | v71.8,82.14 72.12,81.82 v72.12,31.02
  Bottom 0.152: v42.11,92.14 v45.61,92.14 | v41.96,83.72 41.96,82.14 v71.8,82.14 | v72.12,31.02 72.44,31.34 107.2,31.34 109.9,34.03 111.01,34.03 MOD_7.7
M7_X  (via drill 0.33)
  Top 0.152: v66.72,31.02 66.72,49.27 67.2,49.75 67.2,58.64 66.88,58.96 66.88,90.23 X.3
  Bottom 0.152: v66.72,31.02 67.36,30.38 106.89,30.38 108.47,31.97 109.58,31.97 MOD_7.6
M7_Y  (via drill 0.33)
  Top 0.152: v84.66,29.75 77.67,36.73 77.67,65.62 78.94,65.62 80.22,66.9 80.22,77.69 85.93,83.41 85.93,90.07 85.77,90.23 Y.3
  Bottom 0.152: v84.66,29.75 108.16,29.75 MOD_7.5
M8_BTN  (via drill 0.33)
  Top 0.152: v24.81,14.35 24.81,15.94 26.88,18 26.88,73.72 26.4,74.2 26.4,87.22 26.88,87.69 26.88,90.07 27.03,90.23 BUTTONS.2
  Bottom 0.152: v24.81,14.35 26.56,12.6 28.62,12.6 29.41,13.4 29.41,13.55 29.73,13.87 89.58,13.87 90.85,12.6 MOD_8.4
M8_LED1  (via drill 0.33)
  Top 0.152: v100.69,23.87 100.53,24.03 100.53,43.08 BLUE_DRIVER.13 | v89.11,19.75 86.72,17.36 86.72,9.74 MOD_8.2
  Bottom 0.152: v100.69,23.87 96.57,19.75 v89.11,19.75
M8_LED2  (via drill 0.33)
  Top 0.152: v100.85,64.04 100.85,68.96 100.69,69.12 ORANGE_DRIVER.13 | v88.47,56.73 88.47,21.33 89.74,20.06 89.74,12.6 88.95,11.81 88.95,11.17 MOD_8.3
  Bottom 0.152: v100.85,64.04 93.55,56.73 v88.47,56.73
M8_POT  (via drill 0.33)
  Top 0.152: v51.32,24.83 50.05,26.1 50.05,79.44 46.24,83.25 46.24,88.01 45.29,88.96 45.29,90.07 45.13,90.23 POTS.2
  Bottom 0.152: v51.32,24.83 55.45,20.7 62.91,20.7 63.55,20.06 73.87,20.06 74.02,20.22 75.45,20.22 78.79,16.89 97.2,16.89 MOD_8.7
M8_X  (via drill 0.33)
  Top 0.152: v63.7,18.32 63.7,18.64 62.12,20.22 62.12,23.4 63.55,24.83 63.55,46.58 66.88,49.91 66.88,58.48 66.25,59.12 66.25,90.07 66.09,90.23 X.2
  Bottom 0.152: v63.7,18.32 65.93,16.09 94.5,16.09 95.14,15.46 MOD_8.6
M8_Y  (via drill 0.33)
  Top 0.152: v85.3,83.72 85.3,90.07 85.14,90.23 Y.2 | v90.38,82.29 89.42,81.34 89.42,38.95 92.92,35.46 92.92,14.03 MOD_8.5
  Bottom 0.152: v85.3,83.72 86.72,82.29 v90.38,82.29
M9_BTN  (via drill 0.33)
  Top 0.152: v24.97,70.7 24.97,91.34 26.88,93.25 26.88,97.38 27.03,97.53 BUTTONS.23 | v28.14,67.53 28.14,15.78 27.03,14.67 27.03,14.35 26.88,14.19 26.88,13.4 33.38,6.89 39.58,6.89 39.58,5.94 42.11,3.39 50.69,3.39 52.27,1.81 70.37,1.81 70.37,4.51 MOD_9.4
  Bottom 0.152: v28.14,67.53 v24.97,70.7
M9_LED1  (via drill 0.33)
  Top 0.152: v101.96,49.11 101.33,49.11 BLUE_DRIVER.15 | v67.67,49.27 67.36,48.96 67.36,5.62 65.45,3.71 MOD_9.2
  Bottom 0.152: v101.96,49.11 101.81,49.27 v67.67,49.27
M9_LED2  (via drill 0.33)
  Top 0.152: v101.17,70.39 101.17,74.99 ORANGE_DRIVER.15 | v70.85,61.66 69.58,60.39 69.58,5.78 67.99,4.19 MOD_9.3
  Bottom 0.152: v101.17,70.39 99.58,68.8 97.68,68.8 97.04,68.16 97.04,65.15 74.34,65.15 v70.85,61.66
M9_POT  (via drill 0.33)
  Top 0.152: v45.29,101.19 45.29,97.85 45.13,97.69 POTS.23 | v74.18,100.87 74.5,100.55 74.5,81.66 73.07,80.23 73.07,6.73 74.02,5.78 74.02,5.46 74.18,5.3 74.18,4.98 74.98,4.19 77.83,4.19 77.83,5.94 MOD_9.7
  Bottom 0.152: v45.29,101.19 45.61,100.87 v74.18,100.87
M9_X  (via drill 0.33)
  Top 0.152: v63.23,71.97 63.23,89.91 65.45,92.14 65.45,96.11 65.93,96.58 65.93,97.53 X.23 | v73.71,67.53 73.39,67.21 73.39,7.52 75.29,5.62 MOD_9.6
  Bottom 0.152: v63.23,71.97 67.67,67.53 v73.71,67.53
M9_Y  (via drill 0.33)
  Top 0.152: v80.53,83.72 80.53,88.8 84.03,92.3 84.03,95.63 84.98,96.58 84.98,97.53 Y.23 | v73.87,82.29 72.75,81.18 72.75,5.14 MOD_9.5
  Bottom 0.152: v80.53,83.72 79.1,82.29 v73.87,82.29
M10_BTN  (via drill 0.33)
  Top 0.152: v25.61,73.56 25.61,90.87 27.51,92.77 27.51,97.38 27.67,97.53 BUTTONS.22 | v43.7,72.77 44.02,72.45 44.02,7.21 44.66,6.57 44.66,5.62 44.5,5.46 44.5,5.14 45.45,4.19 48.31,4.19 48.31,4.98 MOD_10.4
  Bottom 0.152: v25.61,73.56 25.76,73.72 33.23,73.72 34.18,72.77 v43.7,72.77
M10_LED1  (via drill 0.33)
  Top 0.152: v93.87,10.86 105.46,22.45 105.46,24.35 104.98,24.35 102.76,26.57 102.76,43.72 100.85,45.62 100.85,48.8 100.69,48.96 BLUE_DRIVER.16
  Bottom 0.152: v93.87,10.86 92.92,9.9 89.26,9.9 85.14,5.78 81.33,5.78 78.94,3.39 70.53,3.39 68.94,1.81 47.99,1.81 45.45,4.35 44.97,4.35 43.38,5.94 MOD_10.2
M10_LED2  (via drill 0.33)
  Top 0.152: v100.53,74.04 100.53,74.99 ORANGE_DRIVER.16 | v52.12,74.67 51.48,74.04 51.48,25.62 51.96,25.14 51.96,11.65 45.92,5.62 MOD_10.3
  Bottom 0.152: v100.53,74.04 98.63,75.94 53.39,75.94 v52.12,74.67
M10_POT  (via drill 0.33)
  Top 0.152: v49.42,94.99 47.2,94.99 45.92,96.26 45.92,97.38 45.77,97.53 POTS.22 | v52.91,95.15 52.75,94.99 52.75,77.69 53.07,77.37 53.07,72.13 52.12,71.18 52.12,54.99 53.39,53.72 53.39,5.94 52.12,4.66 52.12,4.03 51.96,3.87 51.96,3.55 52.75,2.76 55.77,2.76 55.77,3.55 MOD_10.7
  Bottom 0.152: v49.42,94.99 49.58,95.15 v52.91,95.15
M10_X
  Top 0.152: X.22 66.72,97.53 66.56,97.38 66.56,93.56 65.77,92.77 65.77,91.98 63.86,90.07 63.86,71.02 56.72,63.88 56.72,49.91 59.26,47.37 59.26,34.83 55.61,31.18 55.61,6.41 53.39,4.19 MOD_10.6
M10_Y  (via drill 0.33)
  Top 0.152: v81.17,81.02 81.17,88.8 85.61,93.25 85.61,97.53 Y.22 | v71.48,76.9 71.48,5.14 71.64,4.98 71.64,2.6 70.53,1.49 50.69,1.49 v50.69,2.44
  Bottom 0.152: v81.17,81.02 79.42,79.28 73.87,79.28 v71.48,76.9 | v50.69,2.44 50.69,4.51 MOD_10.5
M11_BTN  (via drill 0.33)
  Top 0.152: v29.57,91.66 28.62,92.61 28.62,97.38 28.46,97.53 BUTTONS.21 | v27.03,86.9 28.3,85.63 28.3,68.32 28.78,67.85 28.78,14.51 28.3,14.03 MOD_11.4
  Bottom 0.152: v29.57,91.66 27.51,89.6 27.35,89.6 27.03,89.28 v27.03,86.9
M11_LED1  (via drill 0.33)
  Top 0.152: v100.22,45.94 100.22,48.8 100.06,48.96 BLUE_DRIVER.17
  Bottom 0.152: v100.22,45.94 112.92,45.94 114.66,44.19 115.46,44.19 116.09,43.56 116.09,37.69 112.44,34.03 112.44,30.38 105.46,23.4 105.46,20.7 103.71,20.7 97.04,14.03 94.66,14.03 94.03,14.67 94.03,14.82 93.07,15.78 27.51,15.78 26.56,16.73 24.02,16.73 MOD_11.2
M11_LED2  (via drill 0.33)
  Top 0.152: v100.06,70.39 100.06,73.4 99.9,73.56 99.9,74.99 ORANGE_DRIVER.17 | v86.56,67.53 86.25,67.21 86.25,22.45 v78.94,15.14
  Bottom 0.152: v100.06,70.39 98.79,69.12 96.57,69.12 94.98,67.53 v86.56,67.53 | v78.94,15.14 78.79,15.3 26.08,15.3 MOD_11.3
M11_POT  (via drill 0.33)
  Top 0.152: v46.24,98.96 46.24,97.69 POTS.21 | v47.51,98.96 49.26,100.71 55.29,100.71 55.29,12.29 v54.02,11.02
  Bottom 0.152: v47.51,98.96 v46.24,98.96 | v54.02,11.02 53.86,10.86 35.77,10.86 34.65,9.74 MOD_11.7
M11_X  (via drill 0.33)
  Top 0.152: v67.2,95.63 67.2,97.38 67.36,97.53 X.21 | v54.34,93.25 53.7,92.61 53.7,66.1 53.39,65.78 53.39,54.2 54.02,53.56 v54.02,11.97
  Bottom 0.152: v67.2,95.63 67.04,95.47 56.56,95.47 v54.34,93.25 | v54.02,11.97 53.23,11.17 32.43,11.17 MOD_11.6
M11_Y  (via drill 0.33)
  Top 0.152: v81.8,83.72 81.8,88.96 86.25,93.41 86.25,97.53 Y.21 | v70.53,79.44 68.31,77.21 v68.31,13.24
  Bottom 0.152: v81.8,83.72 80.06,81.98 74.5,81.98 71.96,79.44 v70.53,79.44 | v68.31,13.24 67.67,12.6 30.37,12.6 MOD_11.5
M12_BTN  (via drill 0.33)
  Top 0.152: v26.24,48.48 26.24,68.48 24.34,70.39 24.34,91.18 25.45,92.3 25.45,102.45 26.4,102.45 28.78,100.07 28.78,97.85 28.94,97.69 BUTTONS.20
  Bottom 0.152: v26.24,48.48 10.21,32.45 10.21,30.06 12.9,30.06 MOD_12.4
M12_LED1  (via drill 0.33)
  Top 0.152: v101.33,52.29 101.33,51.66 99.58,49.91 99.58,49.27 99.42,49.11 BLUE_DRIVER.18
  Bottom 0.152: v101.33,52.29 100.85,52.77 94.19,52.77 92.92,54.04 48.62,54.04 47.99,53.4 35.61,53.4 33.07,50.86 26.88,50.86 10.21,34.19 MOD_12.2
M12_LED2  (via drill 0.33)
  Top 0.152: v99.42,73.09 99.42,74.99 ORANGE_DRIVER.18 | v104.66,71.66 104.34,71.34 v104.34,36.26
  Bottom 0.152: v99.42,73.09 100.85,71.66 v104.66,71.66 | v104.34,36.26 99.74,31.65 49.58,31.65 47.99,30.06 14.65,30.06 12.75,31.97 11.63,31.97 MOD_12.3
M12_POT  (via drill 0.33)
  Top 0.152: v38.94,82.29 38.94,94.52 39.58,95.15 39.58,115.63 44.02,115.63 44.5,115.16 44.5,115 44.66,114.84 44.66,114.2 46.88,111.98 46.88,97.69 POTS.20 | v21.16,78.8 11.48,69.12 11.48,33.72 10.21,32.45 10.21,29.43 15.92,23.71 17.19,23.71 MOD_12.7
  Bottom 0.152: v38.94,82.29 35.45,78.8 v21.16,78.8
M12_X  (via drill 0.33)
  Top 0.152: v67.83,92.45 67.83,97.38 67.99,97.53 X.20 | v38.3,91.5 37.67,90.87 37.67,55.94 37.83,55.78 37.83,50.86 32.75,45.78 29.41,45.78 v29.41,29.43
  Bottom 0.152: v67.83,92.45 66.88,91.5 v38.3,91.5 | v29.41,29.43 25.76,25.78 15.92,25.78 MOD_12.6
M12_Y  (via drill 0.33)
  Top 0.152: v86.88,98.96 86.88,97.69 Y.20 | v24.49,100.55 21.8,97.85 21.8,78.01 11.79,68.01 11.79,33.56 14.33,31.02 14.33,27.84 MOD_12.5
  Bottom 0.152: v86.88,98.96 84.03,101.82 27.03,101.82 25.76,100.55 v24.49,100.55
M13_BTN  (via drill 0.33)
  Top 0.152: v29.89,92.93 29.89,97.38 29.73,97.53 BUTTONS.19 | v9.57,87.69 5.44,83.56 5.44,78.33 2.74,75.63 2.74,64.99 2.11,64.35 2.11,53.4 4.97,50.54 MOD_13.4
  Bottom 0.152: v29.89,92.93 24.02,87.06 11.16,87.06 10.52,87.69 v9.57,87.69
M13_LED1  (via drill 0.33)
  Top 0.152: v99.11,54.04 99.11,51.34 98.95,51.18 98.95,49.27 98.79,49.11 BLUE_DRIVER.19
  Bottom 0.152: v99.11,54.04 97.04,56.1 4.65,56.1 4.01,55.47 MOD_13.2
M13_LED2  (via drill 0.33)
  Top 0.152: v100.06,84.36 100.06,77.21 98.95,76.1 98.95,75.31 98.79,75.15 ORANGE_DRIVER.19
  Bottom 0.152: v100.06,84.36 98.47,85.94 30.53,85.94 30.21,86.26 12.59,86.26 7.67,81.34 6.55,81.34 3.54,78.33 3.54,68.32 2.11,66.9 2.11,53.08 4.49,53.08 MOD_13.3
M13_POT  (via drill 0.33)
  Top 0.152: v47.51,95.63 47.51,97.38 47.67,97.53 POTS.19 | v37.19,55.47 v37.19,94.83
  Bottom 0.152: v47.51,95.63 46.72,94.83 v37.19,94.83 | v37.19,55.47 35.13,53.4 16.87,53.4 6.55,43.08 MOD_13.7
M13_X  (via drill 0.33)
  Top 0.152: v57.35,84.99 62.91,90.55 62.91,114.2 64.18,115.47 64.18,118.17 67.99,118.17 69.26,116.9 69.26,116.42 69.1,116.27 69.1,115.79 68.47,115.16 68.47,97.85 68.63,97.69 X.19 | v19.41,80.71 10.37,71.66 10.37,59.59 8.78,58.01 6.87,58.01 6.87,46.42 6.08,45.62 MOD_13.6
  Bottom 0.152: v57.35,84.99 57.04,84.67 23.38,84.67 v19.41,80.71
M13_Y  (via drill 0.33)
  Top 0.152: v87.52,96.42 87.52,97.53 Y.19 | v83.39,94.83 79.9,91.34 79.9,68.96 79.58,68.64 77.67,68.64 v77.67,66.26
  Bottom 0.152: v87.52,96.42 85.93,94.83 v83.39,94.83 | v77.67,66.26 77.04,65.62 67.04,65.62 62.75,61.34 48.31,61.34 47.99,61.02 28.94,61.02 24.65,56.73 3.54,56.73 2.74,55.94 2.74,54.04 4.01,54.04 4.17,54.2 5.13,54.2 6.24,53.08 6.24,48 5.6,48 MOD_13.5
M14_BTN  (via drill 0.33)
  Top 0.152: v22.11,74.36 22.11,89.44 25.13,92.45 25.13,103.09 26.88,103.09 30.21,99.76 30.21,97.69 BUTTONS.18
  Bottom 0.152: v22.11,74.36 20.37,72.61 5.6,72.61 MOD_14.4
M14_LED1  (via drill 0.33)
  Top 0.152: v101.96,34.83 101.96,44.03 101.01,44.03 99.42,45.62 99.42,45.94 98.31,47.05 98.31,48.8 98.15,48.96 BLUE_DRIVER.20 | v27.51,34.51 27.19,34.83 v27.19,75.63
  Bottom 0.152: v101.96,34.83 99.11,31.97 49.42,31.97 47.83,30.38 31.64,30.38 v27.51,34.51 | v27.19,75.63 25.45,77.37 6.55,77.37 MOD_14.2
M14_LED2  (via drill 0.33)
  Top 0.152: v98,74.04 98,74.99 ORANGE_DRIVER.20 | v56.24,76.9 v57.83,75.31
  Bottom 0.152: v98,74.04 96.72,75.31 v57.83,75.31 | v56.24,76.9 48.62,76.9 48.15,76.42 34.5,76.42 34.34,76.58 33.07,76.58 32.75,76.26 28.78,76.26 27.51,74.99 6.08,74.99 MOD_14.3
M14_POT  (via drill 0.33)
  Top 0.152: v54.02,65.47 54.97,66.42 54.97,100.39 49.42,100.39 48.47,99.44 48.47,97.69 POTS.18
  Bottom 0.152: v54.02,65.47 52.27,63.72 22.91,63.72 21.64,64.99 4.01,64.99 MOD_14.7
M14_X  (via drill 0.33)
  Top 0.152: v69.1,98.96 69.1,97.85 69.26,97.69 X.18 | v21.16,97.38 20.84,97.06 20.84,81.18 v11,71.34
  Bottom 0.152: v69.1,98.96 68.63,98.49 49.89,98.49 49.42,98.01 33.23,98.01 32.59,97.38 v21.16,97.38 | v11,71.34 7.19,67.53 4.49,67.53 MOD_14.6
M14_Y  (via drill 0.33)
  Top 0.152: v84.82,101.98 86.25,101.98 88.15,100.07 88.15,97.85 88.31,97.69 Y.18 | v23.86,105.15 21.32,105.15 21.32,103.57 20.52,102.77 20.52,82.93 v9.57,71.97
  Bottom 0.152: v84.82,101.98 83.07,103.72 25.61,103.72 24.81,104.52 24.81,105.15 v23.86,105.15 | v9.57,71.97 7.67,70.07 5.13,70.07 MOD_14.5
M15_BTN  (via drill 0.33)
  Top 0.152: v30.84,94.83 30.84,97.53 BUTTONS.17
  Bottom 0.152: v30.84,94.83 28.78,92.77 14.49,92.77 MOD_15.4
M15_LED1  (via drill 0.33)
  Top 0.152: v97.2,53.4 97.2,49.27 97.36,49.11 BLUE_DRIVER.21 | v52.75,55.47 53.07,55.78 53.07,71.66 53.39,71.97 v53.39,93.25
  Bottom 0.152: v97.2,53.4 95.14,55.47 v52.75,55.47 | v53.39,93.25 51.8,94.83 50.21,94.83 49.58,94.2 32.91,94.2 30.68,96.42 17.51,96.42 17.19,96.74 MOD_15.2
M15_LED2  (via drill 0.33)
  Top 0.152: v97.04,97.53 97.04,93.41 97.52,92.93 97.52,75.15 ORANGE_DRIVER.21
  Bottom 0.152: v97.04,97.53 96.72,97.85 52.91,97.85 52.59,98.17 50.05,98.17 49.58,97.69 33.38,97.69 32.43,96.74 19.1,96.74 17.67,98.17 16.71,98.17 15.92,97.38 15.92,94.83 MOD_15.3
M15_POT  (via drill 0.33)
  Top 0.152: v49.1,99.12 49.1,97.69 POTS.17 | v18.14,100.39 10.37,92.61 10.37,88.8 10.21,88.64 10.21,86.42 MOD_15.7
  Bottom 0.152: v49.1,99.12 48.62,99.6 19.89,99.6 19.1,100.39 v18.14,100.39
M15_X  (via drill 0.33)
  Top 0.152: v69.74,99.6 69.74,97.85 69.9,97.69 X.17 | v19.26,97.53 18.46,96.74 18.46,94.2 12.75,88.48 11.63,88.48 MOD_15.6
  Bottom 0.152: v69.74,99.6 50.53,99.6 49.26,98.33 32.91,98.33 32.59,98.01 20.68,98.01 20.21,97.53 v19.26,97.53
M15_Y  (via drill 0.33)
  Top 0.152: v88.79,101.03 88.79,97.85 88.95,97.69 Y.17
  Bottom 0.152: v88.79,101.03 81.8,108.01 31.95,108.01 30.68,109.28 26.88,109.28 21.48,103.88 20.37,103.88 13.7,97.22 13.7,93.72 13.54,93.72 13.06,93.25 13.06,90.55 MOD_15.5
M16_BTN
  Top 0.152: BUTTONS.16 31.48,97.69 31.48,106.74 30.37,107.85 MOD_16.4
M16_LED1  (via drill 0.33)
  Top 0.152: v96.88,47.05 96.88,48.96 BLUE_DRIVER.22
  Bottom 0.152: v96.88,47.05 105.61,47.05 105.77,47.21 114.66,47.21 115.14,46.73 115.78,46.73 115.93,46.58 116.25,46.58 119.43,49.75 119.43,70.7 116.57,73.56 116.57,81.02 113.87,83.72 113.87,87.06 108.16,92.77 108.16,96.11 107.36,96.11 103.23,100.23 90.53,100.23 82.12,108.65 59.9,108.65 57.99,110.55 34.65,110.55 MOD_16.2
M16_LED2  (via drill 0.33)
  Top 0.152: v96.88,89.12 97.04,88.96 97.04,77.37 96.88,77.21 96.88,75.15 ORANGE_DRIVER.22 | v61.8,90.39 59.74,92.45 59.74,107.85 v58.94,108.65
  Bottom 0.152: v96.88,89.12 95.61,90.39 v61.8,90.39 | v58.94,108.65 58.31,109.28 32.43,109.28 MOD_16.3
M16_POT  (via drill 0.33)
  Top 0.152: v49.73,99.76 49.73,97.85 49.58,97.69 POTS.16
  Bottom 0.152: v49.73,99.76 49.58,99.92 22.43,99.92 20.52,101.82 20.52,103.57 23.86,103.57 MOD_16.7
M16_X  (via drill 0.33)
  Top 0.152: v70.53,104.36 70.53,97.69 X.16
  Bottom 0.152: v70.53,104.36 69.9,105 26.24,105 MOD_16.6
M16_Y  (via drill 0.33)
  Top 0.152: v89.42,99.44 89.42,97.85 89.58,97.69 Y.16
  Bottom 0.152: v89.42,99.44 82.44,106.42 28.3,106.42 MOD_16.5
MUX1_S0  (via drill 0.33)
  Top 0.152: v50.21,88.01 50.05,88.17 50.05,90.07 50.21,90.23 POTS.10 | v44.66,87.69 44.34,87.37 44.34,74.36 43.07,73.09 v43.07,58.16
  Bottom 0.152: v50.21,88.01 49.89,88.33 45.29,88.33 v44.66,87.69 | v43.07,58.16 42.27,57.37 32.43,57.37 TEENSY++.D7
MUX1_S1  (via drill 0.33)
  Top 0.152: v50.69,89.12 50.69,90.07 50.85,90.23 POTS.11 | v44.18,88.64 44.02,88.48 44.02,74.52 42.43,72.93 v42.43,60.39
  Bottom 0.152: v50.69,89.12 50.21,88.64 v44.18,88.64 | v42.43,60.39 41.96,59.91 32.43,59.91 TEENSY++.D6
MUX1_S2  (via drill 0.33)
  Top 0.152: v51.01,94.2 51.01,97.53 POTS.14 | v35.92,91.5 35.29,90.87 35.29,63.4 35.61,63.09 35.61,62.45 35.29,62.13 32.43,62.13 32.43,62.29 TEENSY++.D5
  Bottom 0.152: v51.01,94.2 50.37,93.56 37.99,93.56 v35.92,91.5
MUX1_S3  (via drill 0.33)
  Top 0.152: v52.27,97.53 51.64,97.53 POTS.13 | v34.65,97.06 34.65,67.21 32.43,64.99 TEENSY++.D4
  Bottom 0.152: v52.27,97.53 51.8,97.06 v34.65,97.06
MUX1_SIG
  Top 0.152: POTS.1 44.5,90.23 44.66,90.07 44.66,89.12 45.29,88.48 45.29,49.43 47.51,47.21 TEENSY++.F1
MUX2_S0  (via drill 0.33)
  Top 0.152: v68.94,48.16 68.94,75.31 71.17,77.53 71.17,90.23 X.10
  Bottom 0.152: v68.94,48.16 68.47,47.69 49.89,47.69 48.15,45.94 33.54,45.94 32.43,47.05 TEENSY++.C1
MUX2_S1  (via drill 0.33)
  Top 0.152: v71.8,84.99 71.8,90.23 X.11 | v42.59,83.09 38.78,79.28 v38.78,52.77
  Bottom 0.152: v71.8,84.99 69.9,83.09 v42.59,83.09 | v38.78,52.77 35.77,49.75 32.43,49.75 TEENSY++.C0
MUX2_S2  (via drill 0.33)
  Top 0.152: v71.8,98.96 71.8,97.85 71.96,97.69 X.14 | v37.83,100.55 36.56,99.28 36.56,87.85 36.88,87.53 36.88,83.41 35.92,82.45 35.92,63.72 36.24,63.4 36.24,56.1 32.43,52.29 TEENSY++.E1
  Bottom 0.152: v71.8,98.96 70.21,100.55 v37.83,100.55
MUX2_S3  (via drill 0.33)
  Top 0.152: v73.23,87.22 73.23,96.9 72.59,97.53 X.13 | v36.24,87.22 35.61,86.58 35.61,63.56 35.92,63.24 35.92,58.32 32.43,54.83 TEENSY++.E0
  Bottom 0.152: v73.23,87.22 73.07,87.06 36.4,87.06 v36.24,87.22
MUX2_SIG  (via drill 0.33)
  Top 0.152: v61.8,43.88 61.8,58.48 62.75,59.43 62.75,64.83 64.18,66.26 64.18,89.12 65.29,90.23 X.1
  Bottom 0.152: v61.8,43.88 61.16,44.51 47.67,44.51 TEENSY++.F2
MUX3_S0  (via drill 0.33)
  Top 0.152: v89.11,38.32 89.11,81.98 90.06,82.93 90.06,90.07 90.22,90.23 Y.10
  Bottom 0.152: v89.11,38.32 83.87,33.08 35.29,33.08 32.91,30.7 31.8,30.7 31.16,31.34 31.16,36.89 32.27,36.89 TEENSY++.C5
MUX3_S1  (via drill 0.33)
  Top 0.152: v90.69,89.12 90.69,90.07 90.85,90.23 Y.11 | v38.3,87.69 38.15,87.53 38.15,45.3 32.43,39.59 TEENSY++.C4
  Bottom 0.152: v90.69,89.12 90.06,89.75 40.37,89.75 v38.3,87.69
MUX3_S2  (via drill 0.33)
  Top 0.152: v106.89,49.59 106.89,90.87 108.16,92.14 108.16,95.31 101.01,102.45 101.01,103.88 99.58,103.88 94.34,109.12 90.38,109.12 90.06,108.81 90.06,108.65 89.58,108.17 89.58,107.38 90.85,106.11 90.85,97.69 Y.14 | v37.51,49.11 33.7,45.3 33.7,43.4 32.43,42.13 TEENSY++.C3
  Bottom 0.152: v106.89,49.59 106.73,49.75 91.8,49.75 91.64,49.59 91.01,49.59 90.53,50.07 48.94,50.07 48.15,50.86 39.42,50.86 37.67,49.11 v37.51,49.11
MUX3_S3  (via drill 0.33)
  Top 0.152: v92.44,83.41 92.44,91.18 91.8,91.82 91.8,97.38 91.64,97.53 Y.13 | v43.38,78.8 41.8,77.21 41.8,50.7 38.46,47.37 38.46,43.88 32.91,38.32 31.16,38.32 31.16,43.4 32.27,44.51 TEENSY++.C2
  Bottom 0.152: v92.44,83.41 90.69,81.66 74.66,81.66 71.8,78.8 v43.38,78.8
MUX3_SIG  (via drill 0.33)
  Top 0.152: v82.44,81.02 82.44,88.33 84.34,90.23 Y.1 | v52.12,76.26 50.69,74.83 v50.69,43.88
  Bottom 0.152: v82.44,81.02 80.37,78.96 78.94,78.96 76.25,76.26 v52.12,76.26 | v50.69,43.88 48.94,42.13 47.67,42.13 TEENSY++.F3
MUX4_S0  (via drill 0.33)
  Top 0.152: v34.02,71.82 34.02,73.72 31.95,73.72 31.16,74.52 31.16,81.18 32.11,82.14 32.11,90.07 32.27,90.23 BUTTONS.10
  Bottom 0.152: v34.02,71.82 35.77,70.07 47.51,70.07 TEENSY++.B3
MUX4_S1  (via drill 0.33)
  Top 0.152: v32.75,84.04 32.75,90.07 32.91,90.23 BUTTONS.11 | v36.56,68.01 v36.56,82.14
  Bottom 0.152: v32.75,84.04 34.65,82.14 v36.56,82.14 | v36.56,68.01 37.03,67.53 47.51,67.53 TEENSY++.B2
MUX4_S2  (via drill 0.33)
  Top 0.152: v34.02,75.94 34.18,76.1 34.18,93.41 33.07,94.52 33.07,97.53 BUTTONS.14 | v45.92,74.52 46.4,74.04 46.4,66.1 47.51,64.99 TEENSY++.B1
  Bottom 0.152: v34.02,75.94 35.45,74.52 v45.92,74.52
MUX4_S3  (via drill 0.33)
  Top 0.152: v34.97,62.77 34.97,93.88 35.29,94.2 35.29,97.69 33.7,97.69 BUTTONS.13
  Bottom 0.152: v34.97,62.77 35.29,62.45 47.51,62.45 TEENSY++.B0
MUX4_SIG  (via drill 0.33)
  Top 0.152: v26.24,71.82 26.24,73.88 26.08,74.04 26.08,89.91 26.4,90.23 BUTTONS.1 | v44.66,69.28 44.97,68.96 44.97,42.13 47.51,39.59 TEENSY++.F4
  Bottom 0.152: v26.24,71.82 26.88,71.18 34.18,71.18 36.08,69.28 v44.66,69.28
N$1
  Top 0.152: LED1.C 62.59,31.49 59.74,31.49 R12.1
O_A0  (via drill 0.33)
  Top 0.152: v93.07,70.23 93.07,69.44 92.92,69.28 ORANGE_DRIVER.1 | v81.48,71.34 81.8,71.66 v81.8,77.69 83.71,79.59 SJ_A6.2 | v79.26,78.33 79.26,78.96 78.63,79.59 R34.2
  Bottom 0.152: v93.07,70.23 91.96,71.34 v81.48,71.34 | v79.26,78.33 79.9,77.69 v81.8,77.69
O_A1  (via drill 0.33)
  Top 0.152: v93.23,68.16 93.23,68.96 93.39,69.12 ORANGE_DRIVER.2 | v82.28,68.32 82.12,68.48 82.12,74.99 83.71,76.58 SJ_A7.2 | v77.67,69.28 77.67,75.78 78.47,76.58 R33.2
  Bottom 0.152: v93.23,68.16 93.07,68.32 v82.28,68.32 78.63,68.32 v77.67,69.28
O_A2  (via drill 0.33)
  Top 0.152: v94.03,70.23 94.03,69.28 ORANGE_DRIVER.3 | v84.82,72.29 83.87,73.25 83.87,73.56 SJ_A8.2 | v79.26,72.29 79.26,72.93 78.63,73.56 R32.2
  Bottom 0.152: v94.03,70.23 92.6,71.66 85.45,71.66 85.14,71.97 | v84.82,72.29 85.14,71.97 | v79.26,72.29 79.58,71.97 85.14,71.97
O_A3  (via drill 0.33)
  Top 0.152: v94.66,68.16 94.66,69.12 ORANGE_DRIVER.4 | v84.66,68.96 83.87,69.75 83.87,70.55 SJ_A9.2 | v79.26,69.28 79.26,69.91 78.63,70.55 R31.2
  Bottom 0.152: v94.66,68.16 93.87,68.96 v84.66,68.96 79.58,68.96 v79.26,69.28
O_A4  (via drill 0.33)
  Top 0.152: v95.45,66.9 95.45,69.12 ORANGE_DRIVER.5 | v84.66,66.26 83.87,67.05 83.87,67.53 SJ_A10.2 | v78.63,66.26 78.63,67.53 R30.2
  Bottom 0.152: v95.45,66.9 94.82,66.26 v84.66,66.26 v78.63,66.26
O_A5  (via drill 0.33)
  Top 0.152: v95.3,74.04 95.3,74.83 95.45,74.99 ORANGE_DRIVER.24 | v82.75,72.61 82.91,72.45 82.91,65.47 | 82.91,65.47 83.71,64.67 SJ_A11.2 | 82.91,65.47 82.91,64.67 78.63,64.67 R29.2
  Bottom 0.152: v95.3,74.04 94.66,73.4 88.31,73.4 87.99,73.72 83.87,73.72 v82.75,72.61
OE  (via drill 0.33)
  Top 0.152: v96.25,76.58 96.25,75.15 ORANGE_DRIVER.23 | v98.63,76.9 99.11,77.37 99.11,78.01 R35.1 | v96.25,48 96.25,48.96 BLUE_DRIVER.23 | v101.49,47.69 102.6,48.8 v102.6,52.29 | v98.47,53.4 98.15,53.08 98.15,52.29 R9.1
  Bottom 0.152: v96.25,76.58 96.57,76.9 v98.63,76.9 101.81,73.72 112.76,73.72 115.3,71.18 116.25,71.18 116.41,71.34 117.2,71.34 119.11,69.44 119.11,56.58 117.52,56.58 117.36,56.73 107.04,56.73 v102.6,52.29 101.49,53.4 v98.47,53.4 | v96.25,48 96.57,47.69 v101.49,47.69
PWRIN  (via drill 0.33)
  Top 0.508: v50.21,24.83 50.21,22.6 48.15,20.54 Q1.3
  Bottom 0.508: v50.21,24.83 51.01,25.62 60.69,25.62 J2.PWR
SCL  (via drill 0.33)
  Top 0.152: 92.12,74.04 92.12,75.47 92.6,75.94 94.03,75.94 94.03,75.15 ORANGE_DRIVER.26 | 92.12,74.04 92.12,48.32 93.87,48.32 94.03,48.48 94.03,48.96 BLUE_DRIVER.26 | I2C.2 13.06,61.81 13.06,68.8 14.97,68.8 R11.1 15.13,68.96 15.13,69.91 19.26,69.91 | 19.26,69.91 20.21,68.96 20.84,68.96 R37.1 | 19.26,69.91 v23.54,74.2 | v90.06,74.04 92.12,74.04
  Bottom 0.152: R1.P$1 17.19,61.81 13.06,61.81 I2C.2 | v23.54,74.2 31.48,74.2 32.27,74.99 TEENSY++.D0 32.43,74.99 33.54,73.88 48.15,73.88 48.31,74.04 v90.06,74.04
SDA  (via drill 0.33)
  Top 0.152: 92.44,66.9 92.44,71.18 93.39,72.13 93.39,74.99 ORANGE_DRIVER.27 | 92.44,66.9 92.44,51.97 93.55,50.86 93.55,49.11 BLUE_DRIVER.27 | 15.29,61.18 17.19,59.27 17.19,58.96 R2.P$2 | 15.29,61.18 14.02,62.45 14.02,68.01 15.92,68.01 16.08,68.16 16.08,68.8 17.98,68.8 R10.1 18.14,68.8 19.89,68.8 19.89,68.32 20.21,68.01 23.86,68.01 23.86,68.8 R36.1 23.86,68.96 23.86,70.39 v23.7,70.55 | 15.29,61.18 13.06,58.96 I2C.1 | v92.76,66.9 92.44,66.9
  Bottom 0.152: v23.7,70.55 25.61,72.45 32.27,72.45 TEENSY++.D1 32.43,72.45 34.34,72.45 35.45,71.34 47.99,71.34 52.43,66.9 v92.76,66.9

## Text on the board
tPlace: Orange ID | GND | 5v | (0) | R | (1) | SCL | G | (2) | SDA | (3) | (4) | ENC 1 | ENC 2 | ENC 2 | ENC 1 | (5) | SCL | SDA | BTN | G | R | Blue ID | GND | GND | (0) | (1) | POT SIG | (2) | X SIG | (3) | Y SIG | (4) | BUTTON SIG | (5) | GND | BTN
bPlace: GND | 5v | R | SCL | G | SDA | ENC 2 | ENC 1 | ENC 2 | ENC 1 | SCL | SDA | GND | POT SIG | X SIG | Y SIG | BUTTON SIG
tNames: O | - | + | P | BU | B | X | Y | X | Y | BU | B | + | P | O | - | - | + | O | P | B | X | BU | Y | Y | BU | X | B | P | O | + | - | - | + | O | P | B | X | BU | Y | Y | BU | X | B | O | P | - | + | - | + | O | P | B | X | BU | Y | Y | BU | X | B | P | (-) | O | + | - | - | + | O | P | B | X | BU | Y | Y | BU | X | B | P | O | + | - | - | + | O | P | B | X | BU | Y | (+) | Y | BU | X | B | O | P | (-) | + | - | - | + | O | P | B | X | BU | Y | Y | BU | X | B | P | O | + | - | - | O | P | + | B | BU | Y | X | Y | X | B | BU | P | + | - | O
bNames: ENCODER | (-) | ENC_CTRL | I2C | (+) | (-)